# EAGLE design Gadget-Box-328pb (EAGLE 6.6.0)

## Sheet 1 of 3
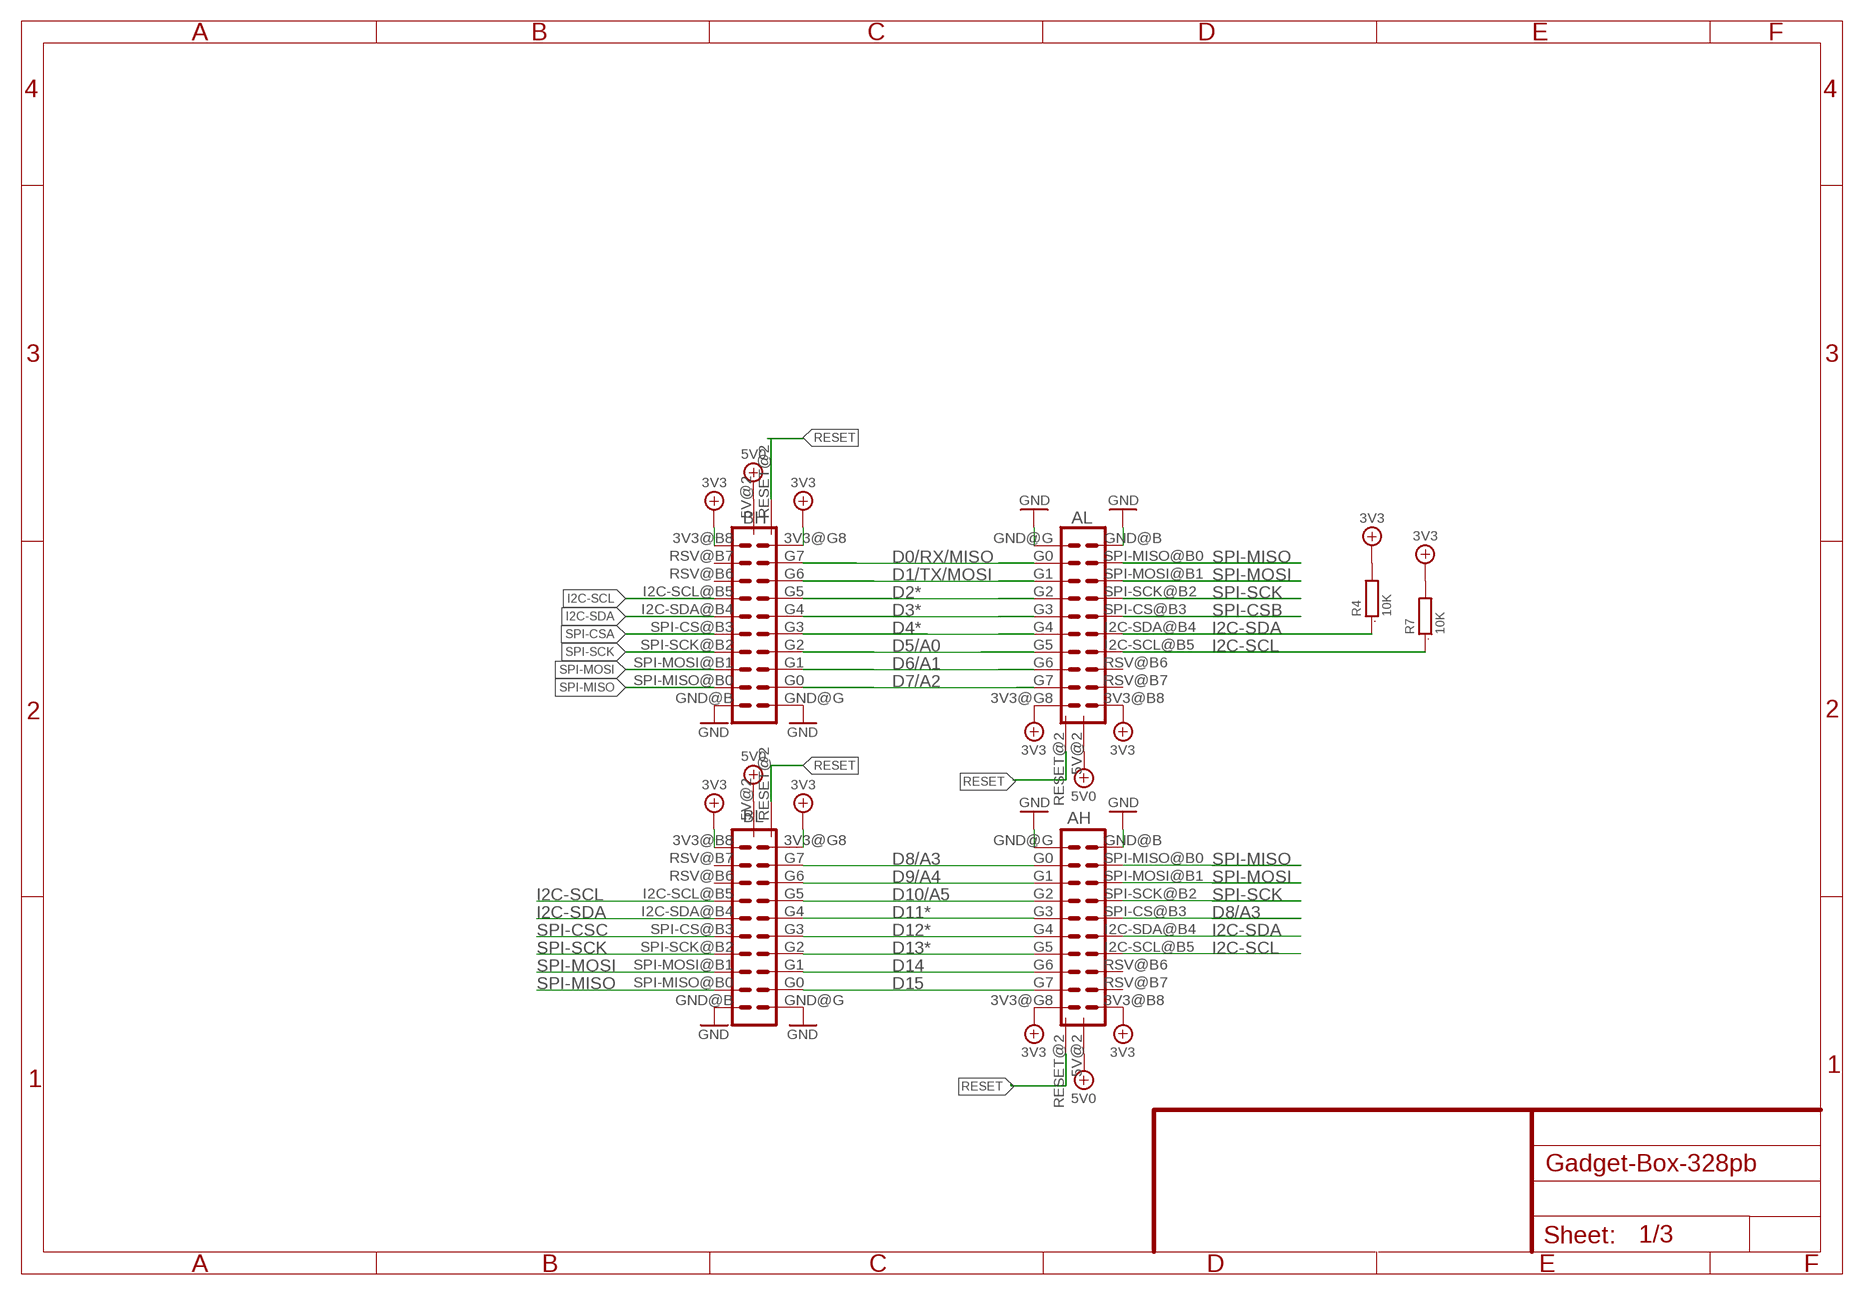
[diagram p0: schematic, sheet 1]

### Parts
AH  ECOGECOG_SLOT_ALT1  [ECOG_ALT1]
AL  ECOGECOG_SLOT_ALT1  [ECOG_ALT1]
BH  ECOGECOG_SLOT_ALT1  [ECOG_ALT1]
BL  ECOGECOG_SLOT_ALT1  [ECOG_ALT1]
R4  10K  R0603  [0603]
R7  10K  R0603  [0603]

### Nets
3V3: AH.3V3@B8(3V3) AH.3V3@G8(3V3) AL.3V3@B8(3V3) AL.3V3@G8(3V3) BH.3V3@B8(3V3) BH.3V3@G8(3V3) BL.3V3@B8(3V3) BL.3V3@G8(3V3) R4.2 R7.2 ; also sheet 2,3
5V0: AH.5V@2(5V) AL.5V@2(5V) BH.5V@2(5V) BL.5V@2(5V) ; also sheet 2
D0/RX/MISO: AL.G0 BH.G7 ; also sheet 3
D1/TX/MOSI: AL.G1 BH.G6 ; also sheet 3
D2*: AL.G2 BH.G5 ; also sheet 3
D3*: AL.G3 BH.G4 ; also sheet 3
D4*: AL.G4 BH.G3 ; also sheet 3
D5/A0: AL.G5 BH.G2 ; also sheet 2,3
D6/A1: AL.G6 BH.G1 ; also sheet 3
D7/A2: AL.G7 BH.G0 ; also sheet 3
D8/A3: AH.G0 AH.SPI-CS@B3(SPI-CS) BL.G7 ; also sheet 3
D9/A4: AH.G1 BL.G6 ; also sheet 3
D10/A5: AH.G2 BL.G5 ; also sheet 3
D11*: AH.G3 BL.G4 ; also sheet 3
D12*: AH.G4 BL.G3 ; also sheet 3
D13*: AH.G5 BL.G2 ; also sheet 3
D14: AH.G6 BL.G1 ; also sheet 3
D15: AH.G7 BL.G0 ; also sheet 3
GND [gnd]: AH.GND@B(GND) AH.GND@G(GND) AL.GND@B(GND) AL.GND@G(GND) BH.GND@B(GND) BH.GND@G(GND) BL.GND@B(GND) BL.GND@G(GND) ; also sheet 2,3
I2C-SCL: AH.I2C-SCL@B5(I2C-SCL) AL.I2C-SCL@B5(I2C-SCL) BH.I2C-SCL@B5(I2C-SCL) BL.I2C-SCL@B5(I2C-SCL) R7.1 ; also sheet 3
I2C-SDA: AH.I2C-SDA@B4(I2C-SDA) AL.I2C-SDA@B4(I2C-SDA) BH.I2C-SDA@B4(I2C-SDA) BL.I2C-SDA@B4(I2C-SDA) R4.1 ; also sheet 3
RESET: AH.RESET@2(RESET) AL.RESET@2(RESET) BH.RESET@2(RESET) BL.RESET@2(RESET) ; also sheet 3
SPI-CSA: BH.SPI-CS@B3(SPI-CS) ; also sheet 3
SPI-CSB: AL.SPI-CS@B3(SPI-CS) ; also sheet 3
SPI-CSC: BL.SPI-CS@B3(SPI-CS) ; also sheet 3
SPI-MISO: AH.SPI-MISO@B0(SPI-MISO) AL.SPI-MISO@B0(SPI-MISO) BH.SPI-MISO@B0(SPI-MISO) BL.SPI-MISO@B0(SPI-MISO) ; also sheet 3
SPI-MOSI: AH.SPI-MOSI@B1(SPI-MOSI) AL.SPI-MOSI@B1(SPI-MOSI) BH.SPI-MOSI@B1(SPI-MOSI) BL.SPI-MOSI@B1(SPI-MOSI) ; also sheet 3
SPI-SCK: AH.SPI-SCK@B2(SPI-SCK) AL.SPI-SCK@B2(SPI-SCK) BH.SPI-SCK@B2(SPI-SCK) BL.SPI-SCK@B2(SPI-SCK) ; also sheet 3
Unconnected: AH.RSV@B6(RSV) AH.RSV@B7(RSV) AL.RSV@B6(RSV) AL.RSV@B7(RSV) BH.RSV@B6(RSV) BH.RSV@B7(RSV) BL.RSV@B6(RSV) BL.RSV@B7(RSV)

## Sheet 2 of 3
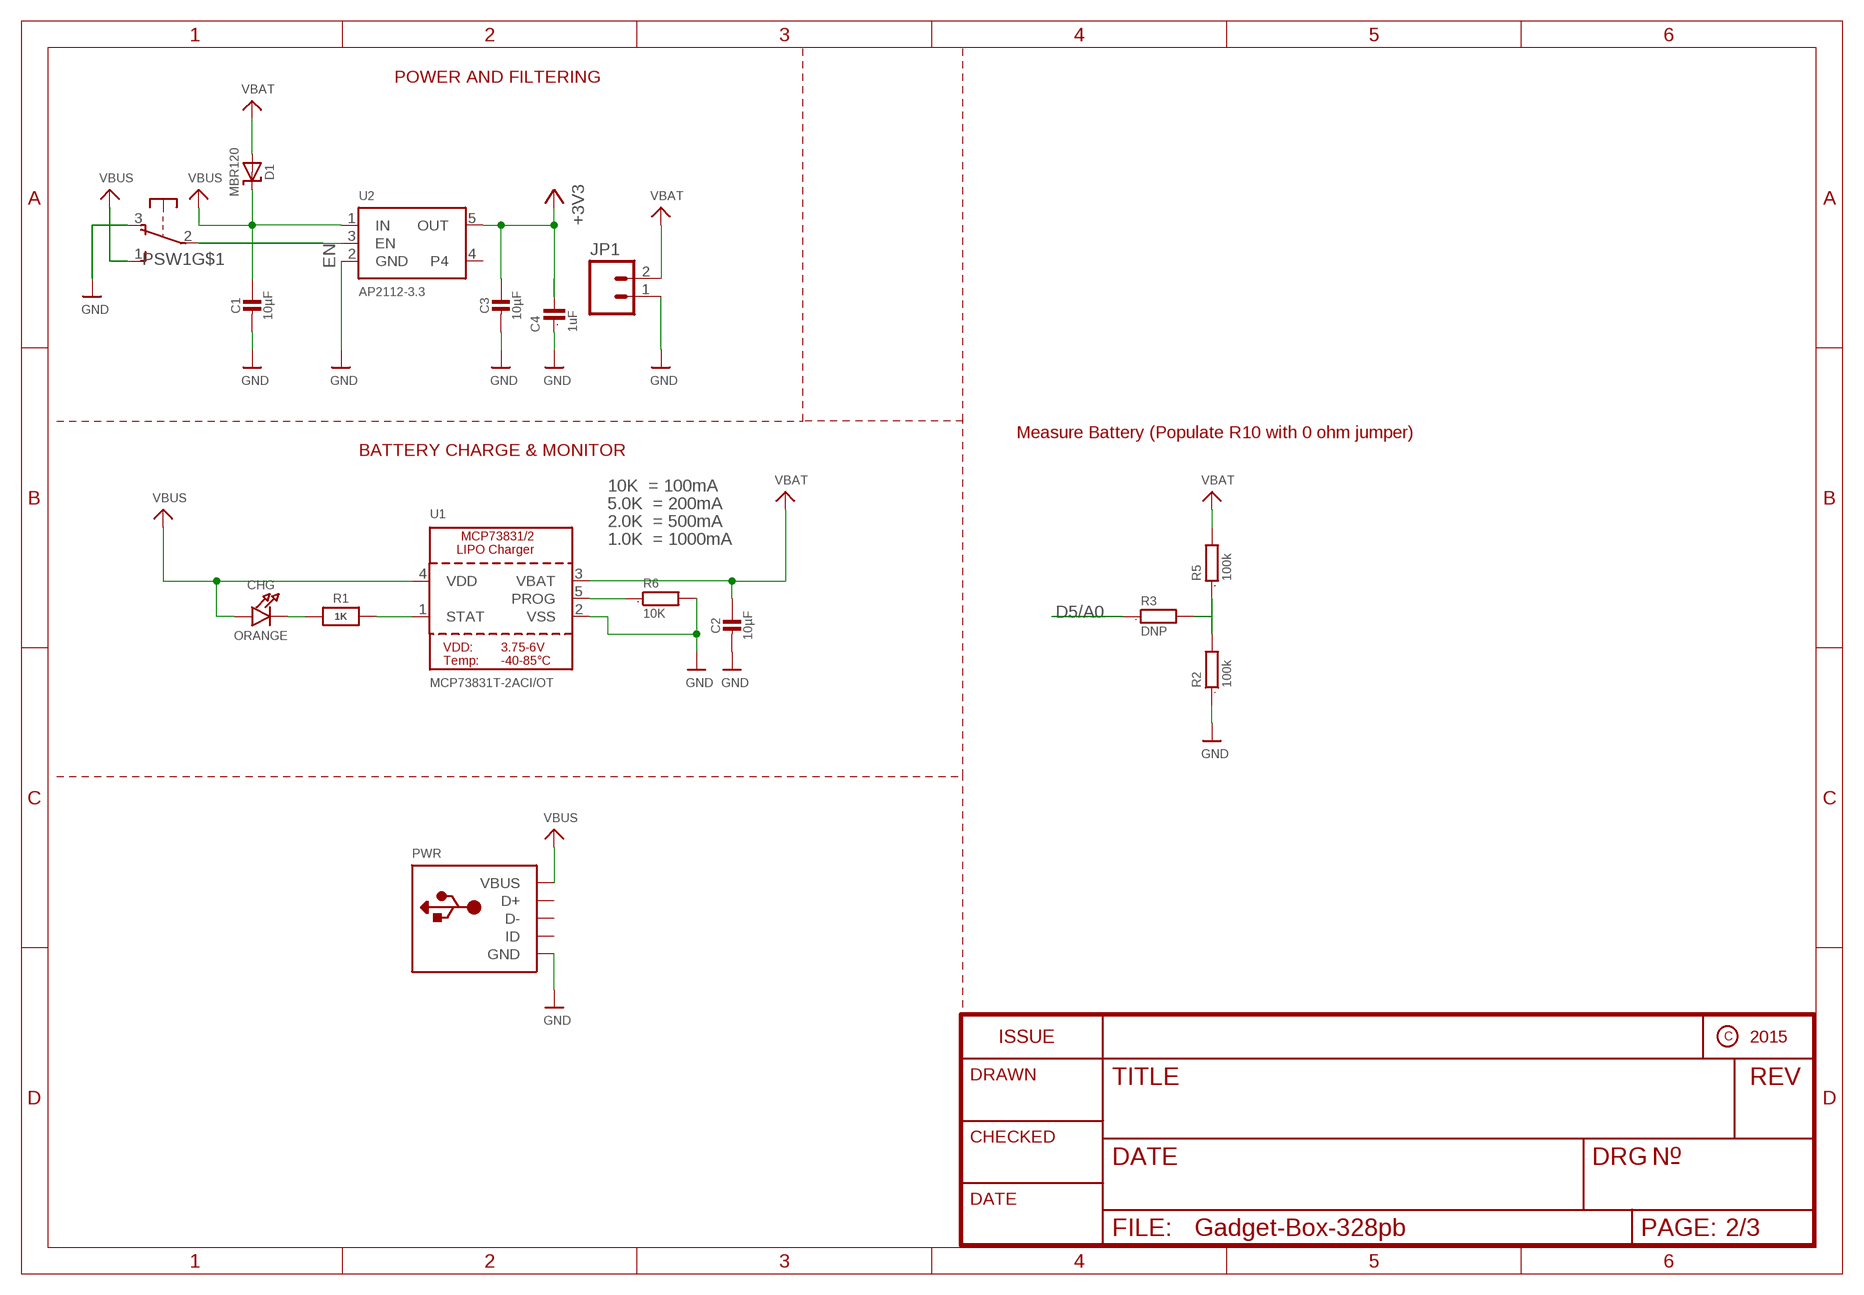
[diagram p1: schematic, sheet 2]

### Parts
C1  10µF  CAP_CERAMIC0805-NOOUTLINE  [0805-NO]
C2  10µF  CAP_CERAMIC0805-NOOUTLINE  [0805-NO]
C3  10µF  CAP_CERAMIC0805-NOOUTLINE  [0805-NO]
C4  1uF  C0603  [0603]
CHG  ORANGE  LED0805_NOOUTLINE  [CHIPLED_0805_NOOUTLINE]
D1  MBR120  DIODE-SCHOTTKYSOD-123  [SOD-123]
JP1  M02-JST-2-PTH-NO_SILK  [JST-2-PTH-NS]
PSW1  OS102011MA1Q  [OS102011MA1Q]
PWR  USBMINIB  [USB-MINIB]
R1  1K  RESISTOR_0603_NOOUT  [0603-NO]
R2  100k  R0603  [0603]
R3  DNP  R0603  [0603]
R5  100k  R0603  [0603]
R6  10K  R0603  [0603]
U1  MCP73831T-2ACI/OT  MCP73831/2  [SOT23-5]
U2  AP2112-3.3  VREG_SOT23-5  [SOT23-5]

### Nets
3V3: C3.1 C4.2 U2.5(OUT) ; supply symbol labelled +3V3 ; also sheet 1,3
5V0: C1.1 CHG.A D1.C PSW1.1(S) PWR.VBUS U1.4(VDD) U2.1(IN) ; supply symbol labelled VBUS ; also sheet 1
D5/A0: R3.1 ; also sheet 1,3
EN: PSW1.2(P) U2.3(EN)
GND [gnd]: C1.2 C2.2 C3.2 C4.1 JP1.1 PSW1.3(O) PWR.GND R2.1 R6.2 U1.2(VSS) U2.2(GND) ; also sheet 1,3
N$1: CHG.C R1.1
N$2: R2.2 R3.2 R5.1
N$3: R1.2 U1.1(STAT)
N$4: R6.1 U1.5(PROG)
VBAT: C2.1 D1.A JP1.2 R5.2 U1.3(VBAT)
Unconnected: PSW1.MT1(MT) PSW1.MT2(MT) PWR.D+ PWR.D- PWR.ID U2.4

### Notes on the sheet
- POWER AND FILTERING
- Measure Battery (Populate R10 with 0 ohm jumper)
- BATTERY CHARGE & MONITOR
- 10K  = 100mA
- 5.0K  = 200mA
- 2.0K  = 500mA
- 1.0K  = 1000mA

## Sheet 3 of 3
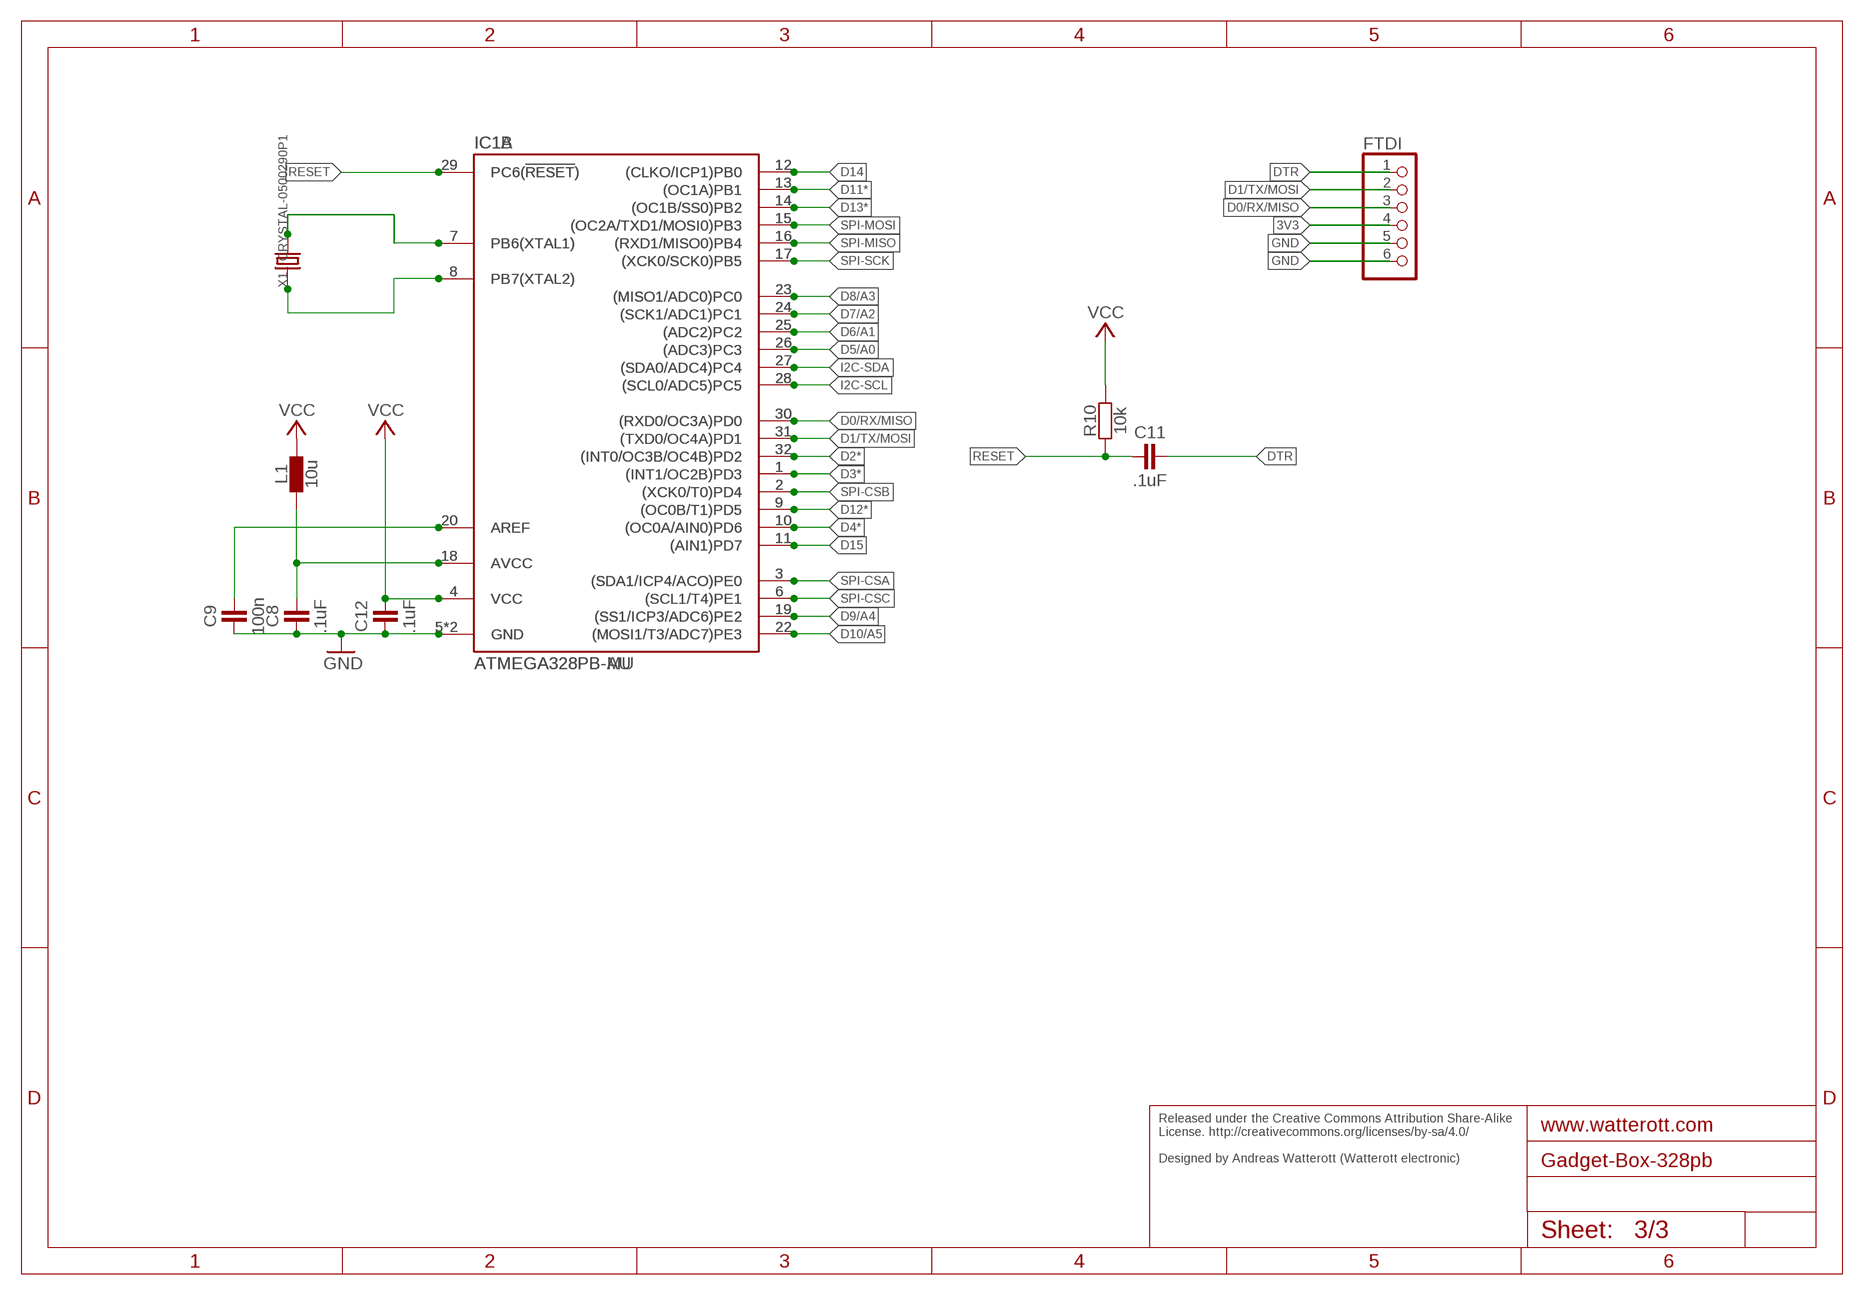
[diagram p2: schematic, sheet 3]

### Parts
C8  .1uF  CAPACITOR-0805  [C0805]
C9  100n  CAPACITOR-0805  [C0805]
C11  .1uF  CAPACITOR-0603  [C0603]
C12  .1uF  CAPACITOR-0805  [C0805]
FTDI  PINHD-1X6  [1X06]
IC1A  ATMEGA328PB-AU  [TQFP32]
IC1B  ATMEGA328PB-MU  [QFN32-PAD]
L1  10u  INDUCTOR-0603  [C0603]
R10  10k  RESISTOR-0603  [C0603]
X1  CRYSTAL-0500290P1  [2P-SMD-5.0X3.2]

### Nets
3V3: C12.2 FTDI.4 IC1A.4(VCC) IC1B.4(VCC) L1.2 R10.2 ; supply symbol labelled VCC ; also sheet 1,2
AREF: C9.2 IC1A.20(AREF) IC1B.20(AREF)
AVCC: C8.2 IC1A.18(AVCC) IC1B.18(AVCC) L1.1
D0/RX/MISO: FTDI.3 IC1A.30((RXD0/OC3A)PD0) IC1B.30((RXD0/OC3A)PD0) ; also sheet 1
D1/TX/MOSI: FTDI.2 IC1A.31((TXD0/OC4A)PD1) IC1B.31((TXD0/OC4A)PD1) ; also sheet 1
D2*: IC1A.32((INT0/OC3B/OC4B)PD2) IC1B.32((INT0/OC3B/OC4B)PD2) ; also sheet 1
D3*: IC1A.1((INT1/OC2B)PD3) IC1B.1((INT1/OC2B)PD3) ; also sheet 1
D4*: IC1A.10((OC0A/AIN0)PD6) IC1B.10((OC0A/AIN0)PD6) ; also sheet 1
D5/A0: IC1A.26((ADC3)PC3) IC1B.26((ADC3)PC3) ; also sheet 1,2
D6/A1: IC1A.25((ADC2)PC2) IC1B.25((ADC2)PC2) ; also sheet 1
D7/A2: IC1A.24((SCK1/ADC1)PC1) IC1B.24((SCK1/ADC1)PC1) ; also sheet 1
D8/A3: IC1A.23((MISO1/ADC0)PC0) IC1B.23((MISO1/ADC0)PC0) ; also sheet 1
D9/A4: IC1A.19((SS1/ICP3/ADC6)PE2) IC1B.19((SS1/ICP3/ADC6)PE2) ; also sheet 1
D10/A5: IC1A.22((MOSI1/T3/ADC7)PE3) IC1B.22((MOSI1/T3/ADC7)PE3) ; also sheet 1
D11*: IC1A.13((OC1A)PB1) IC1B.13((OC1A)PB1) ; also sheet 1
D12*: IC1A.9((OC0B/T1)PD5) IC1B.9((OC0B/T1)PD5) ; also sheet 1
D13*: IC1A.14((OC1B/SS0)PB2) IC1B.14((OC1B/SS0)PB2) ; also sheet 1
D14: IC1A.12((CLKO/ICP1)PB0) IC1B.12((CLKO/ICP1)PB0) ; also sheet 1
D15: IC1A.11((AIN1)PD7) IC1B.11((AIN1)PD7) ; also sheet 1
DTR: C11.2 FTDI.1
GND [gnd]: C8.1 C9.1 C12.1 FTDI.5 FTDI.6 IC1A.5(GND) IC1A.21(GND) IC1B.5(GND) IC1B.21(GND) ; also sheet 1,2
I2C-SCL: IC1A.28((SCL0/ADC5)PC5) IC1B.28((SCL0/ADC5)PC5) ; also sheet 1
I2C-SDA: IC1A.27((SDA0/ADC4)PC4) IC1B.27((SDA0/ADC4)PC4) ; also sheet 1
N$5: IC1A.8(PB7(XTAL2)) IC1B.8(PB7(XTAL2)) X1.1
N$6: IC1A.7(PB6(XTAL1)) IC1B.7(PB6(XTAL1)) X1.2
RESET: C11.1 IC1A.29(PC6(!RESET!)) IC1B.29(PC6(!RESET!)) R10.1 ; also sheet 1
SPI-CSA: IC1A.3((SDA1/ICP4/ACO)PE0) IC1B.3((SDA1/ICP4/ACO)PE0) ; also sheet 1
SPI-CSB: IC1A.2((XCK0/T0)PD4) IC1B.2((XCK0/T0)PD4) ; also sheet 1
SPI-CSC: IC1A.6((SCL1/T4)PE1) IC1B.6((SCL1/T4)PE1) ; also sheet 1
SPI-MISO: IC1A.16((RXD1/MISO0)PB4) IC1B.16((RXD1/MISO0)PB4) ; also sheet 1
SPI-MOSI: IC1A.15((OC2A/TXD1/MOSI0)PB3) IC1B.15((OC2A/TXD1/MOSI0)PB3) ; also sheet 1
SPI-SCK: IC1A.17((XCK0/SCK0)PB5) IC1B.17((XCK0/SCK0)PB5) ; also sheet 1

### Notes on the sheet
- Released under the Creative Commons Attribution Share-Alike 
  License. http://creativecommons.org/licenses/by-sa/4.0/
  
  Designed by Andreas Watterott (Watterott electronic)

## Library data of the parts
AH AL BH BL = eCogs:ECOG; PARTNO: PPPC102LFBN-RC,SULLINS CONNECTOR SOLUTIONS,dk,S6106-ND,"CONN HEADER FEM 20POS.1"" DL GOLD", REF67
C1-C3 = microbuilder:CAP_CERAMIC: Ceramic Capacitors For new designs, use the packages preceded by an '_' character since they are more reliable: The following footprints should be used on most boards: _0402 - Standard footprint for regular board layouts _0603 - Standard footprint for regular board layouts _0805 - Standard footprint for regular board layouts _1206 - Standard footprint for regular board layouts For extremely tight-pitch boards where space is at a premium, the following 'micro-pitch' footprints can be used (smaller pads, no silkscreen outline, etc.): _0402MP - Micro-pitch footprint for very dense/compact boards _0603MP - Micro-pitch footprint for very dense/compact boards _0805MP - Micro-pitch footprint for very dense/compact boards _1206MP - Micro-pitch footprint for very dense/compact boards; PARTNO: CL21F106ZPFNNNE,Samsung,DK,1276-3012-1-ND,CAP CER 10UF 10V Y5V 0805, REF1
C4 = GadgetFactory:C: CAPACITOR, European symbol; PARTNO: C1608X5R1A105K080AC,TDK CORPORATION (VA),dk,445-1321-1-ND,CAP CER 1UF 10V X5R 0603, REF53
C8 C9 C11 C12 = we-rcl:CAPACITOR: Capacitors ...4.7uF @ 6.3V -> 0402 ...10uF @ 16V -> 0603 ...22uF @ 25V -> 0805
CHG = microbuilder:LED: LED 0603 - 0603 Surface Mount Package 2mA: Green LED - Low Power (3.9mcd, 2ma, 1.7Vf) - Digikey: 475-2709-2-ND Orange LED - Low Power (9.8mcd, 2ma, 1.8Vf) - Digikey: 475-1194-2-ND Red LED - Low Power (5mcd, 2ma, 1.8Vf) - Digikey: 475-1195-2-ND Yellow LED - Low Power (7mcd, 2ma, 1.8Vf) - Digikey: 475-1196-2-ND 5mA: Blue LED - Low Power (17mcd, 5ma, 2.9Vf) - Digikey: LNJ937W8CRACT-ND 0805 - 0805 Surface Mount Package 2mA: Red LED (8.8mcd, 2mA, 1.8Vf, Clear) - Low Power [Digikey: 475-2510-1-ND] Green LED (5mcd, 2mA, 1.8Vf, Clear) - Low Power [Digikey: 475-2730-1-ND] Yellow LED (11.3mcd, 2mA, 1.8Vf, Clear) - Low Power [Digikey: 475-2555-1-ND] 20mA: Red LED (104mcd, 20mA, Diffused) - LS R976 [Digikey: 475-1278-6-ND] Red LED (12mcd, 20mA, 2.0Vf, Clear) - APT2012EC [Digikey: 754-1128-1-ND] Green LED (15mcd, 20mA, 2.2Vf, Clear) - APT2012GC [Digikey: 754-1131-1-ND] Orange LED (160mcd, 20mA, 2.1Vf, Clear) - APT2012SECK [Digikey: 754-1130-1-ND] 1206 - 1206 Surface Mount Package Green LED (26mcd, 20mA, Diffused) - LG N971 [Digikey: 475-1407-6-ND] Red LED (15mcd, 20mA, Diffused) - LH N974 [Digikey: 475-1416-6-ND] Cree - Cree High-Power Surface Mount LEDs XPEBWT-L1-0000-00D50 - White 111lm 350mA 2.9Vf 6200K 110° XTEAWT-00-0000-00000LEE3 - White 114lm 350mA 2.85Vf 5000K 115° Everlight - Everlight 45-21 Series Surface Mount LEDs 45-21/QK2C-B2832AC2CB2/2T - Warm White 2000mcd 20mA 3.25Vf 3050K 120° 45-21/LK2C-B38452C4CB2/2T - Nuetral White 2000mcd 20mA 3.25Vf 4150K 120° 45-21/LK2C-B50634C6CB2/2T - Cold White 2200mcd 20mA 3.25Vf 5650K 120° PLCC2 Reverse Mount LS T77K-J1L2-1-0-2-R18-Z - Red 11.25mcd 2mA 1.8Vf 630nm 120° LO T77K-L1M2-24-Z - Orange 19.6mcd 2mA 1.8Vf 606nm 120° LY T77K-K2M1-26-Z - Yellow 15.7mcd 2mA 1.8Vf 587nm 120°; PARTNO: LTST-C171EKT,LITE-ON INC (VA),DK,160-1422-1-ND,LED RED ORAN CLEAR THIN 0805 SMD, REF6
D1 = microbuilder:DIODE-SCHOTTKY; PARTNO: MBR120VLSFT3G,on semiconductor,dk,MBR120VLSFT3GOSCT-ND ,DIODE SCHOTTKY 20V 1A SOD123FL , REF71
FTDI = GadgetFactory:PINHD-1X6: PIN HEADER
IC1A IC1B = we-chip:ATMEGA328PB: Atmel ATmeg328PB AVR Microcontroller
JP1 = SparkFun:M02: Header 2 Standard 2-pin 0.1" header. Use with straight break away headers (SKU : PRT-00116), right angle break away headers (PRT-00553), swiss pins (PRT-00743), machine pins (PRT-00117), and female headers (PRT-00115). Molex polarized connector foot print use with SKU : PRT-08233 with associated crimp pins and housings.; PARTNO: B2B-PH-SM4-TB(LF)(SN),JST SALES AMERICA INC (VA),dk,455-1734-1-ND ,"2 Positions Header, Shrouded Connector 0.079"" (2.00mm) Through Hole Tin ", REF87
L1 = we-rcl:INDUCTOR: Inductors Ferrite Bead 0603 1.4A 220Ohm @ 100MH, -> Murata BLM18PG221SH1D 0603 1.0A 20Ohm @ 100MH -> Murata BLM18PG300SN1D
PSW1 = adafruit:OS102011MA1Q: OS10201MA1Q through-hole right angle switch http://www.ladyada.net/library/eagle; PARTNO: OS102011MA1QN1,C&K Components,dk,CKN9559-ND,SWITCH SLIDE SPDT 100MA 12V , REF72
PWR = adafruit:USB: USB Connectors USBMINIB - Surface Mount Female Mini-B USB Connector 4UConnector: 06564 By microbuilder.eu Thru-hole RA Female Mini-B USB Connector 4UConnector: 18732 By ladyada.net; PARTNO: USB-M26FTR,On Shore Technology Inc,DK,ED2992CT-ND,MINI-USB-B Connector, REF22
R1 = microbuilder:RESISTOR: Resistors; PARTNO: RC0603JR-071KL,YAGEO (VA),dk,311-1.0KGRTR-ND,RES SMD 1K OHM 5% 1/10W 0603 , REF73
R2 R5 = GadgetFactory:R: RESISTOR, European symbol; PARTNO: RC0603JR-07100KL,YAGEO (VA),dk,311-100KGRCT-ND,RES SMD 100K OHM 5% 1/10W 0603 , REF76
R3 = GadgetFactory:R: RESISTOR, European symbol; BOM: EXCLUDE
R4 R6 R7 = GadgetFactory:R: RESISTOR, European symbol; PARTNO: RC0603JR-0710KL,YAGEO (VA),dk,311-10KGRCT-ND,RES SMD 10K OHM 5% 1/10W 0603 , REF36
R10 = we-rcl:RESISTOR: Resistors
U1 = microbuilder:MCP73831/2: MCP73831/2 LIPO Charger VDD: 3.75 - 6V Temp -40 - 85°C Programmable Charge Rate: 15-500mA NOTE: STAT is a tri-state logic output on the MCP73831 and an open-drain output on the MCP73832. SOT23-5 with 4.2V output and tri-state logic on STAT = MCP73831T-2ACI/OT; PARTNO: MCP73831T-2ACI/OT,MICROCHIP TECHNOLOGY (VA),dk,MCP73831T-2ACI/OTCT-ND,IC CONTROLLR LI-ION 4.2V SOT23-5, REF74
U2 = microbuilder:VREG_SOT23-5: SOT23-5 Fixed Voltage Regulators Part Current Out V Out V In V Dropout θJA (°C/W) TJ (°C) Digikey Part No. ADP121 150mA 3.3V 3.4-5.5V 0.09V @ 150mA -- -- ADP121-AUJZ33R7CT-ND ADP121 150mA 3.0V 3.1-5.5V 0.09V @ 150mA -- -- ADP121-AUJZ30R7CT-ND ADP122 300mA 3.3V 3.4-5.5V 0.085V @ 300mA -- -- ADP122AUJZ-3.3-R7CT-ND ADP1712 300mA 3.3V 3.5-5.5V 0.17V @ 300mA -- -- ADP1712AUJZ-3.3-R7TR-ND AP7311 (Low Cost) 150mA 3.3V 3.5-6V 0.15V @ 150mA -- -- AP7311-33WG-7DICT-ND LD39015M18R 150mA 1.8V 1.9V-5.5V 0.08V @ 100mA -- -- 497-6977-1-ND LP2985A-33DBVR 150mA 3.3V 3.3-16V 0.28V @ 150mA 206 150 296-18479-1-ND MCP1824T-3302E/OT 300mA 3.3V 3.5V-6V 0.2V @ 300mA -- -- MCP1824T-3302E/OTCT-ND MIC5205-2.5YM5 TR 150mA 2.5V 2.7-16V 0.165V @ 150mA -- -- 576-1257-2-ND MIC5205-3.0YM5 TR 150mA 3.0V 3.2V-16V 0.165V @ 150mA -- -- 576-1258-2-ND MIC5205-3.3YM5 TR 150mA 3.3V 3.5V-16V 0.165V @ 150mA -- -- 576-1259-2-ND TPS780330220 150mA 3.3V+2.2V 3.6-5.5V 250mV Max -- -- 296-23332-1-ND TDA3663/N1,135 100mA 3.3V 3.5-45V 0.18V @ 50mA -- -- 568-5343-1-ND Max operating temp can be calculated using θJA, TJ (max junction temperature), and power in watts. Set the "Maximum Ambient Temperature" until it reaches TJ ("Max Junction Temperature"), which is the absolute limit for safe use of the regulator: Heat Sink Temperature Calculator <http://www.daycounter.com/Calculators/Heat-Sink-Temperature-Calculator.phtml> For example, With 12V source into a 3.3V LP2985 and a 30mA load, we are dissipating (12V-3.3V) * 0.03A = 0.261W. With a θJA of 206 °C/W, a TJ of 150°C, and 261mW we can safely use the chip without a heat sink up to 75°C (=147.1°C Junction Temperature).; PARTNO: AP2112K-3.3TRG1,Diodes Incorporated,dk,AP2112K-3.3TRG1DICT-ND,IC REG LDO 3.3V 0.6A SOT25 , REF75
X1 = OPL Eagle Library:CRYSTAL*

## Net classes
2 gnd: width 0.254 mm, drill 0.381 mm, clearance 0.254 mm
3 usbvcc: width 0.254 mm, drill 0.381 mm, clearance 0.254 mm
4 aref: width 0.254 mm, drill 0.381 mm, clearance 0.254 mm

## Board
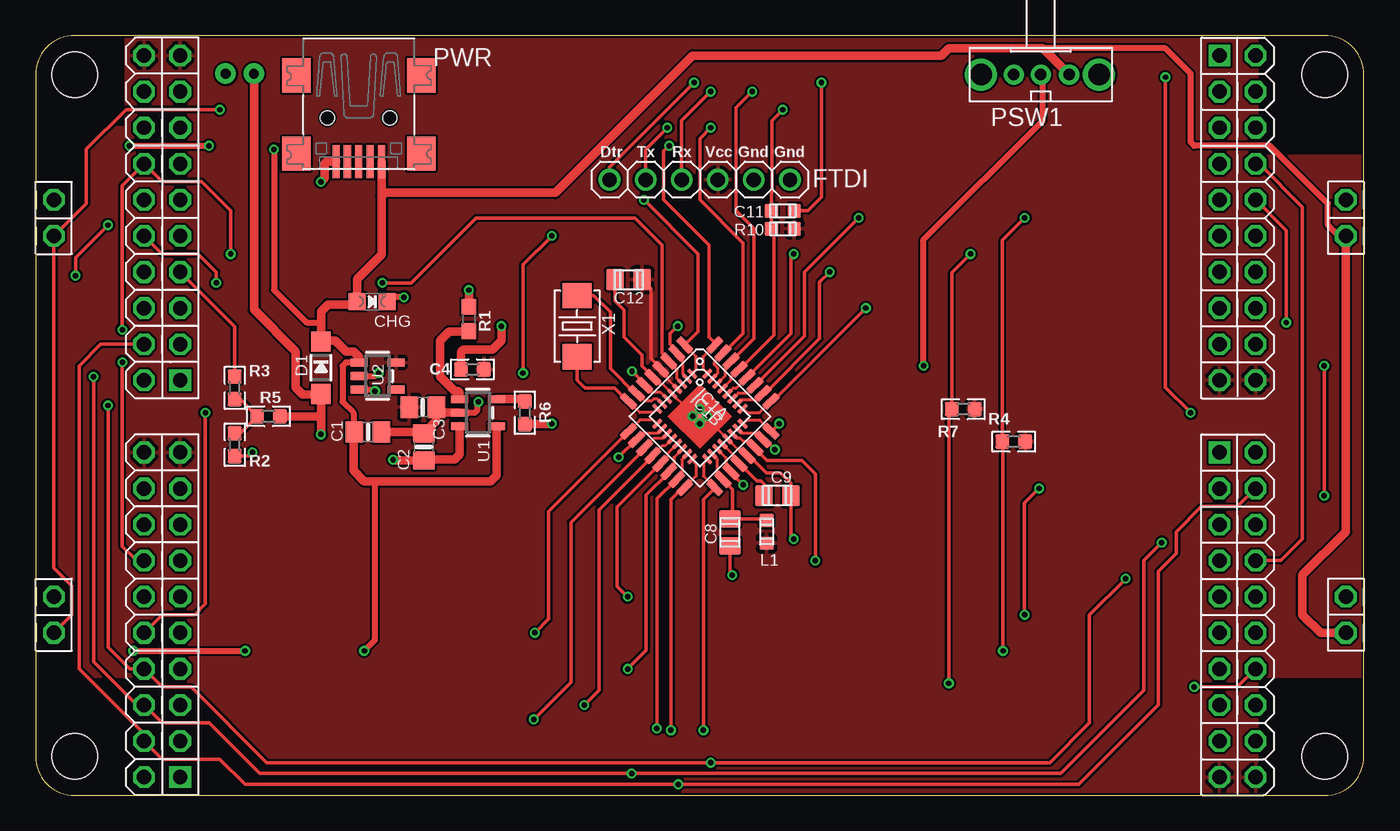
[diagram p3: board, top side]
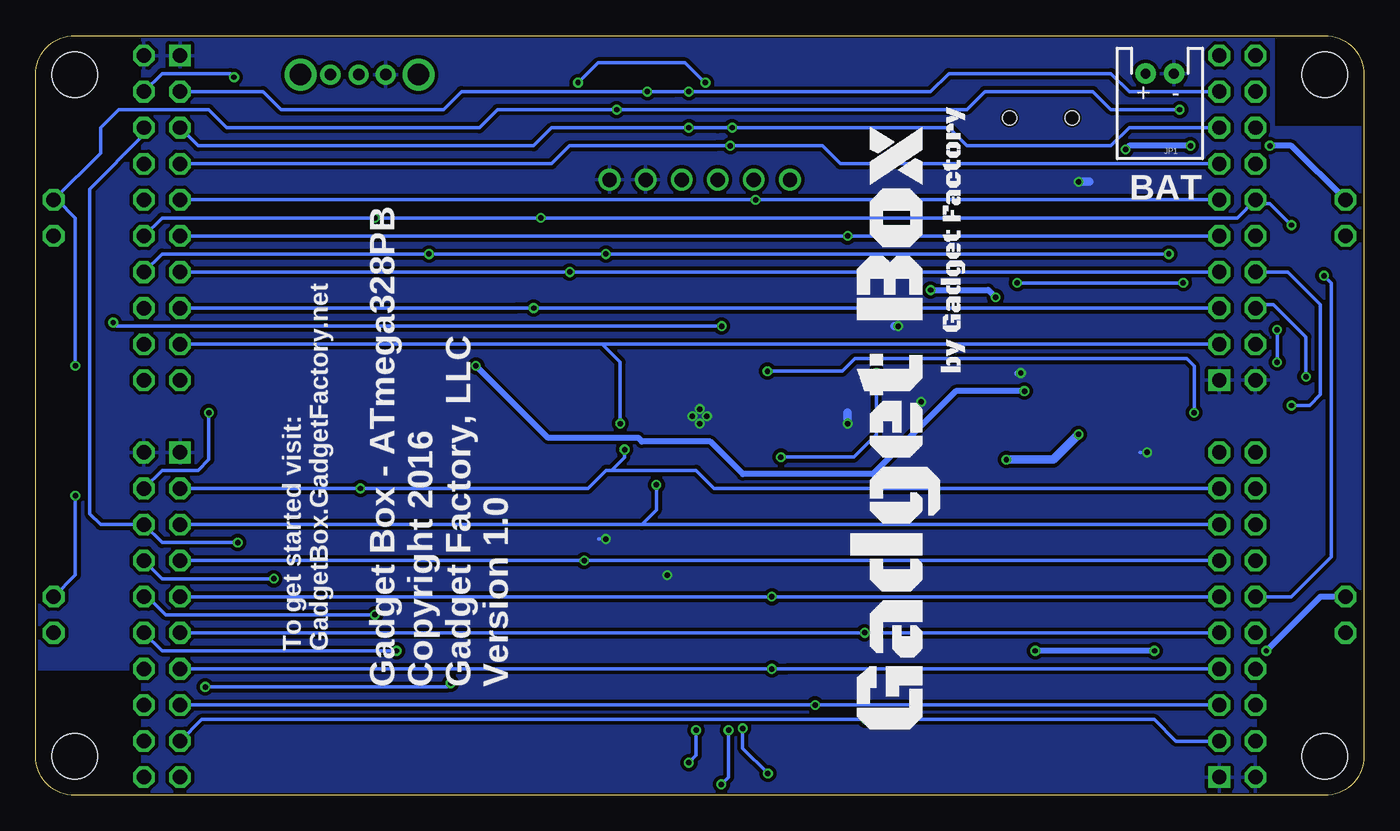
[diagram p4: board, bottom side, seen from below]

Size 93.5 x 53.5 mm. Coordinates in mm from the lower left corner, seen from the top.
Copper layers (1*16): Top 0.035mm / dielectric 1.5mm / Bottom 0.035mm
Design rules "hackvana *": minimum track width 6mil, minimum drill 0.3mm, track to track 6mil, track to pad 6mil, pad to pad 6mil, via to via 6mil, smd to smd 0mil, copper to edge 6mil, drill to drill 6mil, minimum pad ring 10mil, minimum via ring 6mil, stop-mask expansion 2mil, vias tented up to drill 100mil, thermal gap 10mil

### Footprints (pad centres in the part's own frame; a part is rotated, then mirrored left to right if it is on the bottom)
ECOG93P53P5 = hole 3.2: 4,4; 92,4; 92,52; 4,52
ECOG_ALT1 = drill 1.016 octagon: 3V3@B8 21.59,3.81; 3V3@G8 21.59,1.27; 5V@2 11.43,10.16; G0 1.27,1.27; G1 3.81,1.27; G2 6.35,1.27; G3 8.89,1.27; G4 11.43,1.27; G5 13.97,1.27; G6 16.51,1.27; G7 19.05,1.27; GND@B -1.27,3.81; I2C-SCL@B5 13.97,3.81; I2C-SDA@B4 11.43,3.81; RESET@2 8.89,10.16; RSV@B6 16.51,3.81; RSV@B7 19.05,3.81; SPI-CS@B3 8.89,3.81; SPI-MISO@B0 1.27,3.81; SPI-MOSI@B1 3.81,3.81; SPI-SCK@B2 6.35,3.81 | drill 1.016 square: GND@G -1.27,1.27
0805-NO = smd 1.24 x 1.5: 1 -0.95,0; 2 0.95,0
0603 = smd 1 x 1: 1 -0.8,0; 2 0.8,0
C0805 = smd 1.5 x 1.25: 1 0,0.95; 2 0,-0.95
C0603 = smd 1 x 0.95: 1 0,0.8; 2 0,-0.8
CHIPLED_0805_NOOUTLINE = smd 1.2 x 1.2: A 0,-1.05; C 0,1.05
SOD-123 = smd 1.4 x 1.4: A 1.85,0; C -1.85,0
1X06 = drill 1.016: 1 -6.35,0; 2 -3.81,0; 3 -1.27,0; 4 1.27,0; 5 3.81,0; 6 6.35,0
TQFP32 = smd 1.27 x 0.5: 1 -4.293,2.8; 2 -4.293,2; 3 -4.293,1.2; 4 -4.293,0.4; 5 -4.293,-0.4; 6 -4.293,-1.2; 7 -4.293,-2; 8 -4.293,-2.8; 17 4.293,-2.8; 18 4.293,-2; 19 4.293,-1.2; 20 4.293,-0.4; 21 4.293,0.4; 22 4.293,1.2; 23 4.293,2; 24 4.293,2.8 | smd 0.5 x 1.27: 9 -2.8,-4.293; 10 -2,-4.293; 11 -1.2,-4.293; 12 -0.4,-4.293; 13 0.4,-4.293; 14 1.2,-4.293; 15 2,-4.293; 16 2.8,-4.293; 25 2.8,4.293; 26 2,4.293; 27 1.2,4.293; 28 0.4,4.293; 29 -0.4,4.293; 30 -1.2,4.293; 31 -2,4.293; 32 -2.8,4.293
QFN32-PAD = smd 0.8 x 0.26: 1 -2.5,1.75; 2 -2.5,1.25; 3 -2.5,0.75; 4 -2.5,0.25; 5 -2.5,-0.25; 6 -2.5,-0.75; 7 -2.5,-1.25; 8 -2.5,-1.75; 17 2.5,-1.75; 18 2.5,-1.25; 19 2.5,-0.75; 20 2.5,-0.25; 21 2.5,0.25; 22 2.5,0.75; 23 2.5,1.25; 24 2.5,1.75 | smd 0.26 x 0.8: 9 -1.75,-2.5; 10 -1.25,-2.5; 11 -0.75,-2.5; 12 -0.25,-2.5; 13 0.25,-2.5; 14 0.75,-2.5; 15 1.25,-2.5; 16 1.75,-2.5; 25 1.75,2.5; 26 1.25,2.5; 27 0.75,2.5; 28 0.25,2.5; 29 -0.25,2.5; 30 -0.75,2.5; 31 -1.25,2.5; 32 -1.75,2.5 | smd 1.2 x 1.2: TP 0,0
JST-2-PTH-NS = drill 0.7 pad 1.448: 1 -1,0; 2 1,0
OS102011MA1Q = drill 0.8 pad 1.422: 1 -2,0; 2 0,0; 3 1.9,0 | drill 1.5 pad 2.184: MT1 -4.1,0; MT2 4.2,0
USB-MINIB = smd 0.5 x 2.308: D+ 0,4.064; D- -0.8,4.064; GND 1.6,4.064; ID 0.8,4.064; VBUS -1.6,4.064 | smd 2 x 2.4: GND1 -4.4,-2; GND2 -4.4,3.5; GND3 4.4,3.5; GND4 4.4,-2 | hole 1: -2.2,1; 2.2,1
0603-NO = smd 1.1 x 1: 1 -0.85,0; 2 0.85,0
SOT23-5 = smd 0.55 x 1.2: 1 -0.95,-1.3; 2 0,-1.3; 3 0.95,-1.3; 4 0.95,1.3; 5 -0.95,1.3
2P-SMD-5.0X3.2 = smd 1.778 x 2.032: 1 -2.159,0; 2 2.159,0

### Placement (x,y rotation side)
$$U$1  [ECOG93P53P5]  -1.25,-1.25 0 top
AH  82.06,22.88 270 top
AL  82.06,50.82 270 top
BH  11.45,30.5 90 top
BL  11.45,2.56 90 top
C1  23.39,25.59 0 top
C2  27.32,24.53 90 top
C3  27.26,27.34 0 top
C4  30.75,29.99 0 top
C8  48.88,18.52 180 top
C9  52.22,21.1 270 top
C11  52.6,41.17 90 top
C12  41.74,36.31 90 top
CHG  23.68,34.76 270 top
D1  20.09,30.12 270 top
FTDI  46.75,43.35 0 top
IC1A  46.76,26.69 315 top
IC1B  46.76,26.69 315 top
JP1  14.37,50.82 180 bottom
L1  51.45,18.56 0 top
PSW1  70.75,50.75 180 top
PWR  22.75,48.69 180 top
R1  30.5,33.55 270 top
R2  14.02,24.69 90 top
R3  14.02,28.69 270 top
R4  68.85,24.91 0 top
R5  16.4,26.69 0 top
R6  34.44,26.94 270 top
R7  65.3,27.2 0 top
R10  52.6,39.9 90 top
U1  31.13,26.94 270 top
U2  24.07,29.53 270 top
U$100  [GADGETBOX_TEXT]  32.79,25.93 90 bottom
X1  38.12,33.04 90 top

### Tracks (layer width: path | path; a pad name or v marks a point on that pad's centre or on a via)
3V3
  Top 0.203: IC1B.4 44.49,29.31 44.49,29.52 IC1A.4
  Top 0.254: IC1A.4 44,30.08 43.33,30.75 43.33,35.67 C12.2
  pour Top: -1.25,8.37 -1.25,47.03 6.37,47.03 6.37,54.63 85.95,54.63 85.95,45.01 94.92,45.01 94.92,8.37 85.95,8.37 85.95,-1.25 7.64,-1.25 7.64,8.37
5V0  (via drill 0.38)
  Top 0.406: U2.1 21.85,30.48 21.61,30.25 21.61,27.71 22.37,26.94 22.37,25.66 C1.1 | AL.5V@2 91.71,39.39 90.95,40.15 90.95,41.68 86.89,45.74 81.55,45.74 81.3,45.99 81.3,50.82 79.52,52.6 70.9,52.6 | 23.64,22.12 23.9,21.86 23.9,10.94 v23.13,10.18 | v6.88,10.18 v14.75,10.18 | v16.78,45.49 16.78,35.58 19.07,33.29 20.09,33.29 | v6.62,45.74 v12.21,45.74
  Top 0.61: U2.1 22.77,30.86 22.37,31.26 21.86,31.26 21.1,32.02 20.14,32.02 D1.C 20.09,33.29 20.09,34.06 20.59,34.56 22.44,34.56 CHG.A 22.63,34.77 22.63,36.34 24.35,38.07 24.35,42.18 | U1.4 32.44,22.53 32.02,22.12 23.64,22.12 23.13,22.12 22.37,22.88 22.37,25.52 C1.1 | PWR.VBUS 24.35,42.18 | 24.35,42.18 24.6,42.44 36.6,42.44 46.25,52.09 63.77,52.09 64.28,52.6 70.9,52.6 PSW1.1 | AH.5V@2 90.44,11.45 89.17,12.72 89.17,15.51 92.22,18.56 AL.5V@2
  Bottom 0.406: BL.5V@2 3.07,13.99 v6.88,10.18 | v14.75,10.18 v23.13,10.18 | BH.5V@2 5.1,45.74 v6.62,45.74 | v12.21,45.74 16.53,45.74 v16.78,45.49
AREF
  Top 0.203: IC1B.20 49.09,24 49.09,23.79 IC1A.20
  Top 0.254: IC1A.20 49.54,23.37 50.77,22.14 51.05,22.14 51.43,21.76 51.43,21.27 C9.2
AVCC
  Top 0.203: IC1B.18 47.64,24.03 47.95,23.72 47.95,22.67 IC1A.18
  Top 0.254: IC1A.18 48.38,22.17 48.41,22.17 49.04,21.53 49.04,19.64 C8.2 51.34,19.48 L1.1
D0/RX/MISO  (via drill 0.38)
  Top 0.203: IC1B.30 48.56,29.56 48.56,30.19 IC1A.30
  Top 0.254: IC1A.30 48.99,30.57 50.57,32.15 50.57,39.9 49.3,41.17 49.3,48.41 v50.44,49.55 | FTDI.3 45.48,47.51 v47.52,49.55
  Bottom 0.254: AL.G0 77.49,49.55 76.22,48.28 64.79,48.28 63.52,49.55 v50.44,49.55 48.53,49.55 v47.52,49.55 30.5,49.55 29.23,50.82 17.8,50.82 16.53,49.55 BH.G7
D1/TX/MOSI  (via drill 0.38)
  Top 0.203: IC1B.31 47.64,29.35 48.03,29.74 48.03,30.07 47.77,30.32 47.77,30.53 IC1A.31
  Top 0.254: IC1A.31 48.41,31.14 49.8,32.53 49.8,38.88 46.76,41.93 46.76,46.25 v47.52,47.01 | FTDI.2 42.94,45.48 v44.47,47.01
  Bottom 0.254: BH.G6 16.53,47.01 17.8,45.74 27.96,45.74 29.23,47.01 v44.47,47.01 45.49,47.01 v47.52,47.01 57.17,47.01 58.44,45.74 82.06,45.74 AL.G1
D2*  (via drill 0.38)
  Top 0.203: IC1B.32 47.29,29.74 47.01,30.02 47.01,30.9 IC1A.32
  Top 0.254: IC1A.32 47.81,31.86 47.39,32.28 47.39,38.76 44.22,41.93 44.22,45.36 v44.6,45.74
  Bottom 0.254: AL.G2 57.17,44.47 55.9,45.74 45.61,45.74 v44.6,45.74 38.12,45.74 36.85,44.47 BH.G5
D3*  (via drill 0.38)
  Top 0.203: IC1B.1 46.23,29.72 46.5,29.99 46.5,30.9 IC1A.1
  Top 0.254: IC1A.1 45.7,31.73 46.63,32.66 46.63,38.12 v42.82,41.93
  Bottom 0.254: BH.G4 42.31,41.93 v42.82,41.93 AL.G3
D4*  (via drill 0.38)
  Top 0.203: IC1B.10 43.78,25.5 42.73,25.5 IC1A.10
  Top 0.254: IC1A.10 42.29,25.07 v41.04,23.82 | v34.31,29.74 34.31,37.36 v36.34,39.39
  Bottom 0.254: AL.G4 v36.34,39.39 BH.G3 | v41.04,23.82 35.91,23.82 34.31,25.42 v34.31,29.74
D5/A0  (via drill 0.38)
  Top 0.203: IC1B.26 49.73,27.88 50.78,27.88 IC1A.26
  Top 0.254: IC1A.26 51.32,28.31 55.19,32.18 55.19,36.14 v55.9,36.85 | R3.1 14.02,33.01 BH.G2
  Bottom 0.254: BH.G2 v55.9,36.85 57.17,36.85 AL.G5
D6/A1  (via drill 0.38)
  Top 0.203: IC1B.25 49.78,27.22 50.06,26.94 50.97,26.94 IC1A.25
  Top 0.254: IC1A.25 51.88,27.75 v58.44,34.31
  Bottom 0.254: AL.G6 59.71,34.31 v58.44,34.31 BH.G1
D7/A2  (via drill 0.38)
  Top 0.203: IC1B.24 49.78,26.16 50.06,26.44 50.97,26.44 IC1A.24
  Top 0.254: IC1A.24 51.8,25.64 v52.34,26.18
  Bottom 0.254: BH.G0 53.61,31.77 | 53.61,31.77 AL.G7 | v52.34,26.18 52.34,30.5 53.61,31.77
D8/A3  (via drill 0.38)
  Top 0.203: IC1B.23 49.7,25.52 50.75,25.52 IC1A.23
  Top 0.254: IC1A.23 51.32,25.07 v52.04,24.35 | v69.62,12.72 69.62,20.59 v70.63,21.61
  Bottom 0.254: AH.G0 71.14,21.61 v70.63,21.61 54.63,21.61 53.36,22.88 52.95,22.88 | 52.95,22.88 47.01,22.88 45.74,21.61 BL.G7 | v52.04,24.35 52.04,23.79 52.95,22.88 | AH.SPI-CS@B3 85.62,13.99 84.35,12.72 v69.62,12.72
D9/A4  (via drill 0.38)
  Top 0.203: IC1B.19 48.61,23.77 48.61,23.14 IC1A.19
  Top 0.254: IC1A.19 48.94,22.73 v49.8,21.86
  Bottom 0.254: BL.G6 50.82,19.07 | 50.82,19.07 AH.G1 | v49.8,21.86 49.8,20.09 50.82,19.07
D10/A5  (via drill 0.38)
  Top 0.203: IC1B.22 49.35,25.17 49.58,25.17 49.78,24.96 50.18,24.96 IC1A.22
  Top 0.254: IC1A.22 50.64,24.41 51.48,23.57 53.94,23.57 54.88,22.63 v54.88,16.53
  Bottom 0.254: AH.G2 v54.88,16.53 BL.G5
D11*  (via drill 0.38)
  Top 0.203: IC1B.13 45.14,24.75 44.47,24.07 44.47,23.84 IC1A.13
  Top 0.254: IC1A.13 40.94,20.32 40.94,14.73 v41.68,13.99
  Bottom 0.254: BL.G4 v41.68,13.99 42.18,13.99 AH.G3
D12*  (via drill 0.38)
  Top 0.203: IC1B.9 43.73,26.16 43.45,26.44 42.54,26.44 IC1A.9
  Top 0.254: IC1A.9 41.74,25.61 36.11,19.98 36.11,12.41 v35.15,11.45
  Bottom 0.254: AH.G4 v35.15,11.45 33.57,11.45 BL.G3
D13*  (via drill 0.38)
  Top 0.203: IC1B.14 44.93,23.79 44.93,23.16 IC1A.14
  Top 0.254: IC1A.14 44.57,22.75 42.97,21.15 42.97,10.21 v41.68,8.91
  Bottom 0.254: BL.G2 40.66,8.91 v41.68,8.91 AH.G5
D14  (via drill 0.38)
  Top 0.203: IC1B.12 44.32,24.61 44.11,24.61 IC1A.12
  Top 0.254: IC1A.12 43.44,23.88 39.64,20.09 39.64,7.39 v38.63,6.37
  Bottom 0.254: AH.G6 v38.63,6.37 37.1,6.37 BL.G1
D15  (via drill 0.38)
  Top 0.203: IC1B.11 44.14,25.14 43.51,25.14 IC1A.11
  Top 0.254: IC1A.11 42.87,24.41 37.69,19.22 37.69,7.97 v35.07,5.35
  Bottom 0.254: BL.G0 13.23,3.83 14.75,5.35 33.55,5.35 v35.07,5.35 81.81,5.35 AH.G7
DTR  (via drill 0.38)
  Top 0.254: FTDI.1 40.4,44.23 v46.35,50.19 | v55.32,50.19 55.32,42.11 54.38,41.17 C11.2
  Bottom 0.254: v46.35,50.19 46.38,50.19 47.77,51.58 53.92,51.58 v55.32,50.19
EN  (via drill 0.38)
  Top 0.406: U2.3 23.78,28.59 v23.9,28.47 | v62.5,30.25 62.5,39.14 70.89,47.52 70.89,50.61 PSW1.2
  Bottom 0.406: v23.9,28.47 28.72,28.47 34.56,22.63 43.71,22.63 45.99,24.91 50.82,24.91 51.07,25.17 57.42,25.17 v62.5,30.25
GND  (via drill 0.38)
  Top 0.203: IC1A.5 43.9,28.98 44.11,28.98 IC1B.5 45.72,27.38 45.72,27.22 v46.25,26.69 | IC1A.21 49.61,24.4 49.4,24.4 IC1B.21 47.95,25.85 47.95,26 v47.26,26.69
  Top 0.254: IC1A.5 43.44,29.5 42.69,30.25 42.69,31.01 41.42,32.28 41.42,34.18 40.79,34.82 C12.1 | R2.1 15,23.89 v15.26,24.15 | IC1A.21 50.22,23.94 51.45,22.7 52.45,22.7 53.16,21.99 53.16,21.11 C9.1 53.17,18.25 v53.36,18.05 | C8.1 48.88,15.68 v49.04,15.51
  Top 0.406: U1.2 30.93,26.94 31.11,27.12 31.11,27.66 v31.16,27.71 | U2.2 23.95,29.54 v24.15,29.74
  Top 0.61: C1.2 27.22,25.59 C2.2 28.21,26.36 C3.2 28.6,26.94 U1.2 | R6.2 36.3,26.14 v36.34,26.18 | v20.09,43.2 20.34,43.45 20.34,44.47 20.49,44.62 PWR.GND | C4.1 29.95,31.22 30.12,31.39 32.15,31.39 32.79,32.02 v32.79,33.04
  Bottom 0.254: 15.77,24.15 v15.26,24.15 | v53.36,18.05 53.87,18.05 | v49.04,15.51 49.3,15.51
  Bottom 0.406: v24.15,29.74 24.4,29.74
  Bottom 0.61: v36.34,26.18 36.34,26.94 | v20.09,43.2 19.32,43.2 | v32.79,33.04 33.04,33.04
  other vias: 46.76,26.18 46.76,27.2
  pour Bottom: -1.25,8.4 -1.25,47.01 6.37,47.01 6.37,55.14 85.95,55.14 85.95,44.47 94.92,44.47 94.92,8.91 85.95,8.91 85.95,-1.76 7.64,-1.76 7.64,8.4
I2C-SCL  (via drill 0.38)
  Top 0.203: IC1B.28 49.12,28.7 49.33,28.7 IC1A.28
  Top 0.254: IC1A.28 50.09,29.44 53.16,32.51 53.16,37.92 v53.36,38.12 | v13.74,38.12 13.74,41.17 11.7,43.2 8.91,43.2 BH.I2C-SCL@B5 6.12,42.95 v6.12,32.79 | BL.I2C-SCL@B5 7.13,16.53 6.12,17.55 v6.12,30.5 | AH.I2C-SCL@B5 84.6,7.64 v81.55,7.64 | v65.81,38.12 64.5,36.81 R7.1 64.28,26.98 v64.28,7.89
  Bottom 0.254: AL.I2C-SCL@B5 84.6,38.12 v65.81,38.12 v53.36,38.12 v13.74,38.12 | v6.12,30.5 v6.12,32.79 | v81.55,7.64 64.54,7.64 v64.28,7.89
I2C-SDA  (via drill 0.38)
  Top 0.203: IC1B.27 49.47,28.34 50.1,28.34 IC1A.27
  Top 0.254: IC1A.27 54.12,32.35 54.12,36.85 v57.93,40.66 | v2.81,36.6 2.81,37.87 v5.1,40.15 | v68.09,10.18 68.09,24.87 R4.1 68.05,39.1 v69.62,40.66
  Bottom 0.254: AL.I2C-SDA@B4 84.6,40.66 71.14,40.66 v69.62,40.66 v57.93,40.66 8.91,40.66 BH.I2C-SDA@B4 7.39,41.68 6.62,41.68 v5.1,40.15 | BL.I2C-SDA@B4 5.1,13.99 2.31,16.78 2.31,36.09 v2.81,36.6 | AH.I2C-SDA@B4 84.6,10.18 v68.09,10.18
N$1  (via drill 0.38)
  Top 0.406: v25.93,35.07 25.05,35.07 CHG.C
  Top 0.61: v30.5,35.58 R1.1
  Bottom 0.406: v30.5,35.58 26.44,35.58 v25.93,35.07
N$2
  Top 0.254: R3.2 14.4,27.89 R5.1 14.4,25.49 R2.2
N$3
  Top 0.61: U1.1 29.84,28.37 29.74,28.47 29.48,28.47 28.47,29.48 28.47,32.02 29.1,32.66 30.46,32.66 R1.2
N$4
  Top 0.61: U1.5 34.29,27.89 R6.1
N$5
  Top 0.203: IC1B.8 43.73,27.22 43.45,26.94 42.54,26.94 IC1A.8
  Top 0.254: IC1A.8 41.66,27.75 40.74,28.67 38.68,28.67 38.12,29.23 X1.1
N$6
  Top 0.203: IC1A.7 42.34,28.31 42.9,27.76 43.33,27.76 43.48,27.91 43.78,27.91 44.1,27.59 IC1B.7
  Top 0.254: IC1A.7 42.19,28.31 40.46,30.04 40.46,34.03 39.29,35.2 X1.2
RESET  (via drill 0.38)
  Top 0.203: IC1B.29 48.97,29.25 48.97,29.46 IC1A.29
  Top 0.254: IC1A.29 49.57,30.01 51.96,32.41 51.96,39.73 R10.1 C11.1 51.8,42.4 51.84,42.44 51.84,47.52 v52.6,48.28 | v90.7,30.25 v90.7,21.1 | BL.RESET@2 2.56,12.72 2.56,14.75 1.29,16.02 BH.RESET@2 3.58,41.68 3.58,45.49 6.37,48.28 v12.97,48.28
  Bottom 0.254: v12.97,48.28 17.8,48.28 19.07,49.55 26.69,49.55 27.96,48.28 v52.6,48.28 60.98,48.28 62.25,47.01 80.03,47.01 81.3,48.28 87.65,48.28 88.92,47.01 88.92,45.23 AL.RESET@2 91.97,41.93 90.7,40.66 v90.7,30.25 | v90.7,21.1 90.7,15.51 AH.RESET@2
SPI-CSA  (via drill 0.38)
  Top 0.203: IC1B.3 45.16,29.36 45.16,29.97 45,30.12 45,30.14 IC1A.3
  Top 0.254: IC1A.3 44.57,30.68 44.09,31.16 44.09,38.76 42.18,40.66 31.01,40.66 26.44,36.09 v24.4,36.09 | v12.72,36.09 12.72,36.85 11.45,38.12 8.91,38.12 BH.SPI-CS@B3
  Bottom 0.254: v24.4,36.09 v12.72,36.09
SPI-CSB  (via drill 0.38)
  Top 0.203: IC1B.2 45.87,29.35 45.59,29.64 45.59,30.69 IC1A.2
  Top 0.254: 45.13,31.23 IC1A.2 45.13,31.31 44.67,31.77 44.67,32.51 v45.21,33.04 | v88.03,33.29 88.03,39.77 AL.SPI-CS@B3
  Bottom 0.254: v88.03,33.29 87.78,33.04 v45.21,33.04
SPI-CSC  (via drill 0.38)
  Top 0.203: IC1B.6 44.01,28.37 43.38,28.37 IC1A.6
  Top 0.254: IC1A.6 42.87,28.97 v41.98,29.86 | BL.SPI-CS@B3 8.91,12.72 11.2,12.72 11.96,13.48 v11.96,26.94
  Bottom 0.254: v41.98,29.86 36.72,29.86 35.83,30.75 12.47,30.75 11.96,30.25 v11.96,26.94
SPI-MISO  (via drill 0.38)
  Top 0.203: IC1B.16 46.23,23.66 46.5,23.39 46.5,22.48 IC1A.16
  Top 0.254: AH.SPI-MISO@B0 84.6,20.34 82.06,20.34 80.28,18.56 80.28,17.04 79.01,15.77 79.01,6.37 73.43,0.78 v45.23,0.78 14.75,0.78 12.97,2.56 8.91,2.56 BL.SPI-MISO@B0 7.64,4.34 3.07,8.91 3.07,30.25 4.59,31.77 BH.SPI-MISO@B0 | IC1A.16 45.55,21.68 44.72,20.85 v44.72,4.59 | v79.52,50.57 79.52,28.72 v81.3,26.94
  Bottom 0.254: v44.72,4.59 44.72,1.29 v45.23,0.78 | AL.SPI-MISO@B0 84.6,50.82 79.78,50.82 v79.52,50.57 | v81.3,26.94 81.3,23.64 82.06,22.88 84.6,22.88 AH.SPI-MISO@B0
SPI-MOSI  (via drill 0.38)
  Top 0.203: IC1B.15 45.87,24.03 45.49,23.64 45.49,22.59 IC1A.15
  Top 0.254: v79.27,17.8 78,16.53 78,7.39 72.16,1.54 v41.95,1.54 15.77,1.54 12.21,5.1 8.91,5.1 BL.SPI-MOSI@B1 7.13,6.37 4.08,9.42 v4.08,29.48 | IC1A.15 45.1,22.24 43.76,20.9 43.76,4.74 v43.73,4.72
  Bottom 0.254: v79.27,17.8 84.6,17.8 AH.SPI-MOSI@B1 88.92,19.07 89.68,19.83 89.68,42.69 85.87,46.5 AL.SPI-MOSI@B1 | v43.73,4.72 43.73,3.32 v41.95,1.54 | v4.08,29.48 4.08,32.28 6.37,34.56 7.39,34.56 BH.SPI-MOSI@B1
SPI-SCK  (via drill 0.38)
  Top 0.203: IC1B.17 47.29,23.66 47.01,23.39 47.01,22.48 IC1A.17
  Top 0.254: v76.73,15.26 74.19,12.72 74.19,5.1 71.39,2.31 v47.52,2.31 16.28,2.31 10.94,7.64 8.91,7.64 BL.SPI-SCK@B2 6.62,8.91 5.1,10.43 v5.1,27.45 | IC1A.17 47.81,21.65 47.01,20.85 v47.01,4.59 | AL.SPI-SCK@B2 86.13,44.47 89.17,41.42 89.17,18.05 87.65,16.53 AH.SPI-SCK@B2
  Bottom 0.254: v76.73,15.26 84.6,15.26 AH.SPI-SCK@B2 | v47.01,4.59 47.01,2.81 v47.52,2.31 | v5.1,27.45 3.83,27.45 3.07,28.21 3.07,34.56 5.35,36.85 BH.SPI-SCK@B2
VBAT  (via drill 0.38)
  Top 0.61: U1.3 29.84,23.99 29.48,23.64 27.39,23.64 C2.1 25.23,23.58 v25.17,23.64 | v20.09,25.42 20.09,26.69 | 20.09,26.69 D1.A 20.03,28.21 18.82,28.21 18.31,28.72 18.31,31.26 15.37,34.2 JP1.2 | R5.2 20.08,26.69 20.09,26.69
  Bottom 0.61: v25.17,23.64 21.86,23.64 v20.09,25.42

### Text on the board
tPlace: Dtr | Tx | Rx | Vcc | Gnd | Gnd
bPlace: BAT | To get started visit: / GadgetBox.GadgetFactory.net | Gadget Box - ATmega328PB / Copyright 2016 / Gadget Factory, LLC / Version 1.0
Reference: TOP Silkscreen is on layer 200